# EAGLE design LEDBox (EAGLE 9.6.2)
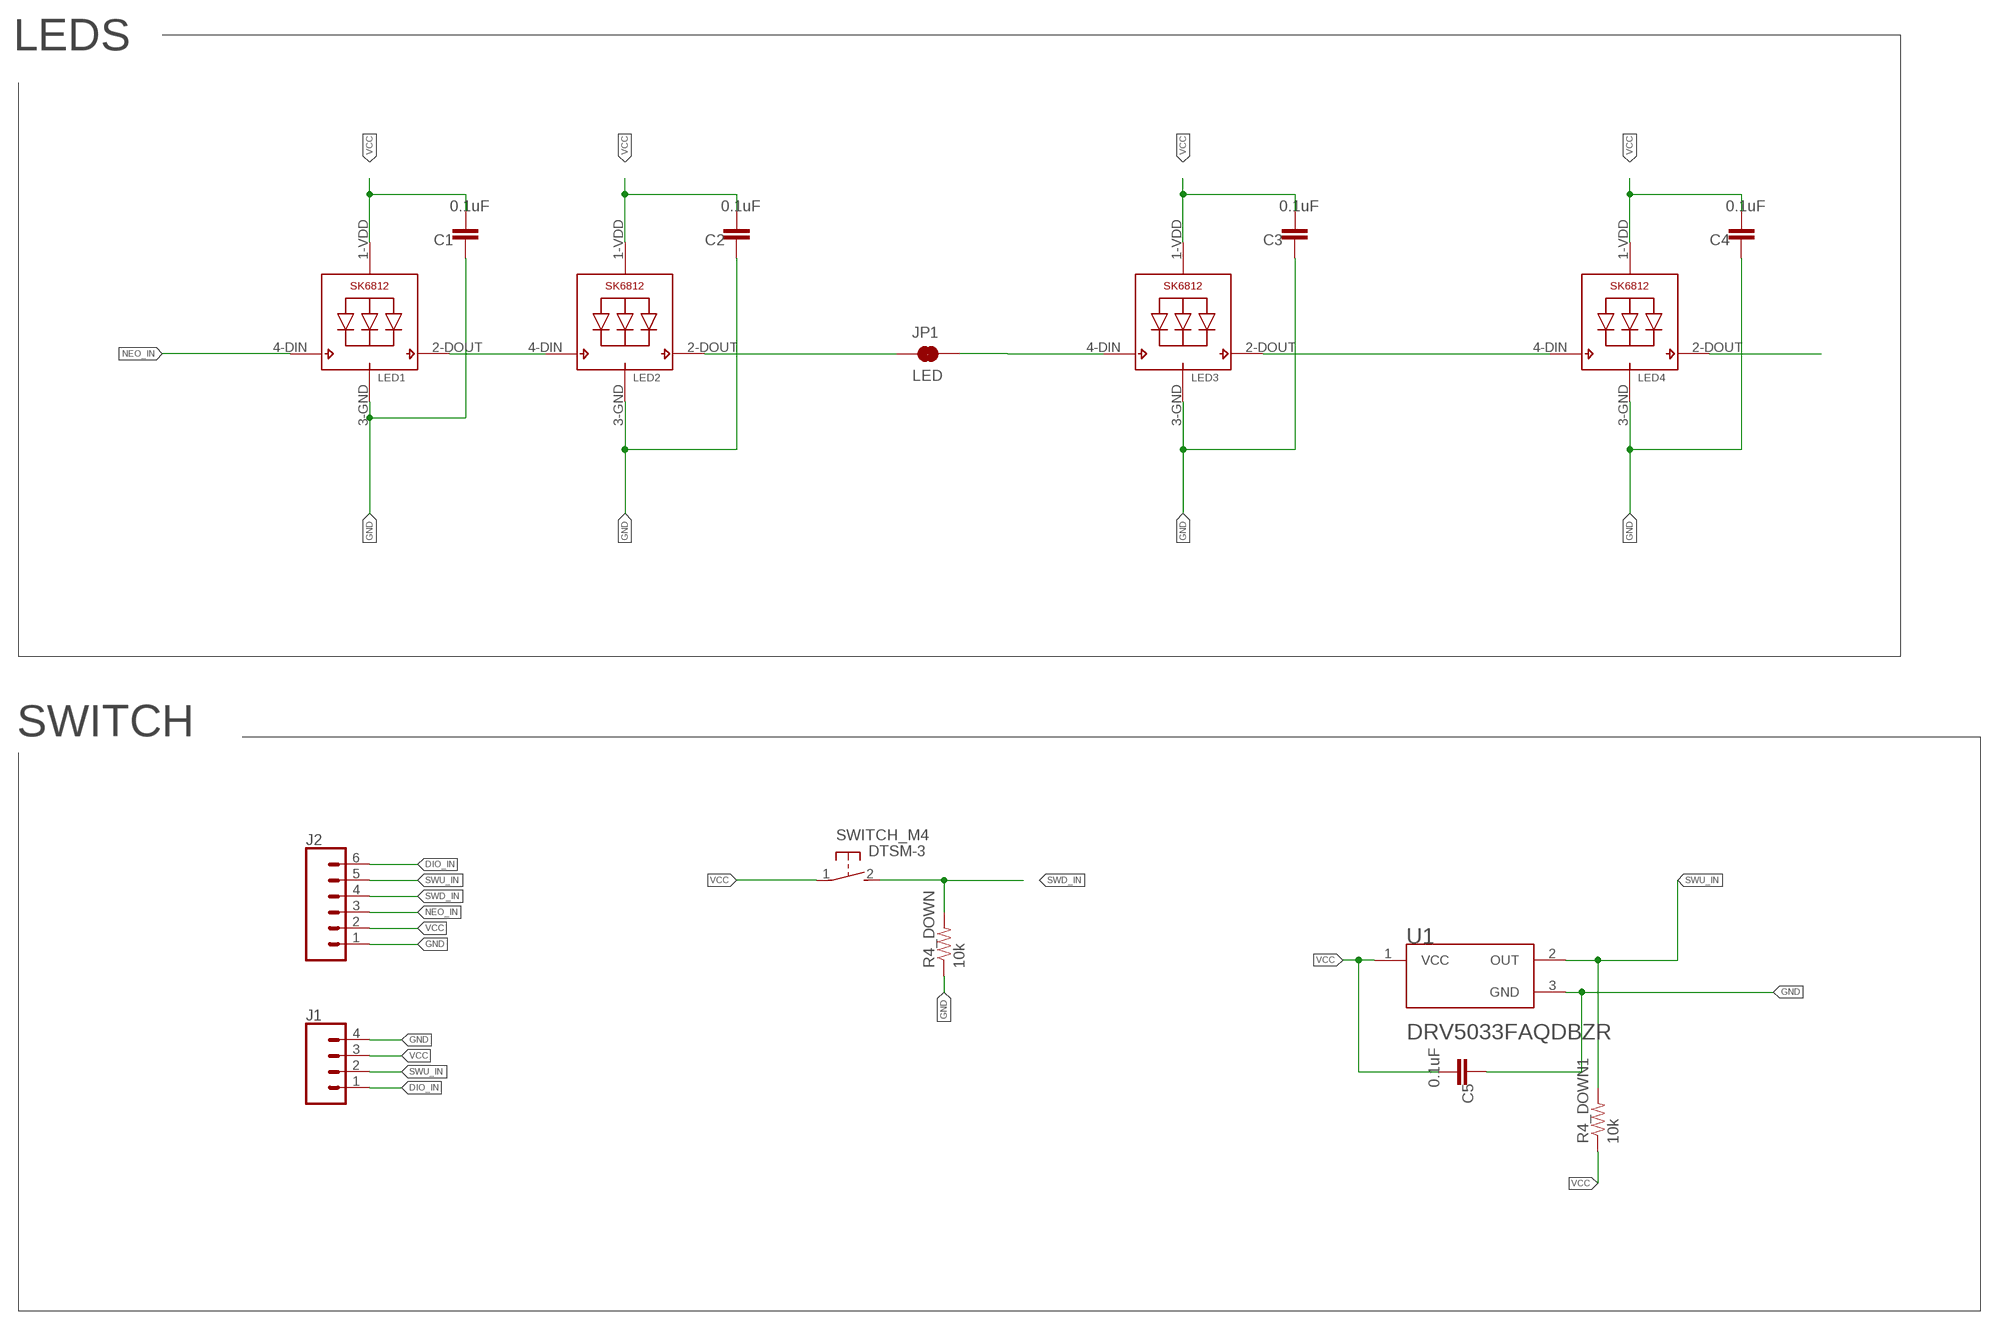
[diagram p0: schematic, sheet 1]

## Parts
C1  0.1uF  0.1UF-0603-25V-5%  [0603]
C2  0.1uF  0.1UF-0603-25V-5%  [0603]
C3  0.1uF  0.1UF-0603-25V-5%  [0603]
C4  0.1uF  0.1UF-0603-25V-5%  [0603]
C5  0.1uF  0.1UF-0603-25V-5%  [0603]
J1  CONN_041X04_NO_SILK  [1X04_NO_SILK]
J2  CONN_06SMD-1MM  [1X06-1MM]
JP1  LED  JUMPER-SMT_2_NC_TRACE_NO-SILK  [SMT-JUMPER_2_NC_TRACE_NO-SILK]
LED1  SK6812_5050W  [LED5050_W]
LED2  SK6812_5050W  [LED5050_W]
LED3  SK6812_5050W  [LED5050_W]
LED4  SK6812_5050W  [LED5050_W]
R4_DOWN  10k  10KOHM-0603-1/10W-1%  [0603]
R4_DOWN1  10k  10KOHM-0603-1/10W-1%  [0603]
SWITCH_M4  DTSM-3  [DTSM-3]
U1  TEXAS_INSTRUMENTS_DRV5033FAQDBZRTEXAS_INSTRUMENTS_DRV5033FAQDBZR_0_0  [TEXAS_INSTRUMENTS_DRV5033FAQDBZR_0]

## Nets
DIO_IN: J1.1 J2.6
GND: C1.1 C2.1 C3.1 C4.1 C5.1 J1.4 J2.1 LED1.3-GND(GND) LED2.3-GND(GND) LED3.3-GND(GND) LED4.3-GND(GND) R4_DOWN.1 U1.3(GND)
N$1: LED1.2-DOUT(DO) LED2.4-DIN(DI)
N$2: JP1.1 LED2.2-DOUT(DO)
N$4: JP1.2 LED3.4-DIN(DI)
N$5: LED4.2-DOUT(DO)
N$6: LED3.2-DOUT(DO) LED4.4-DIN(DI)
NEO_IN: J2.3 LED1.4-DIN(DI)
SWD_IN: J2.4 R4_DOWN.2 SWITCH_M4.2
SWU_IN: J1.2 J2.5 R4_DOWN1.2 U1.2(OUT)
VCC: C1.2 C2.2 C3.2 C4.2 C5.2 J1.3 J2.2 LED1.1-VDD(VDD) LED2.1-VDD(VDD) LED3.1-VDD(VDD) LED4.1-VDD(VDD) R4_DOWN1.1 SWITCH_M4.1 U1.1(VCC)

## Notes on the sheet
- LEDS
- SWITCH

## Library data of the parts
C1-C5 = SparkFun-Capacitors:0.1UF: 0.1µF ceramic capacitors A capacitor is a passive two-terminal electrical component used to store electrical energy temporarily in an electric field.; PROD_ID: CAP-08604
J1 = SparkFun-Connectors:CONN_04: Multi connection point. Often used as Generic Header-pin footprint for 0.1 inch spaced/style header connections On any of the 0.1 inch spaced packages, you can populate with these: Break Away Headers - Straight <https://www.sparkfun.com/products/116> (PRT-00116) Break Away Male Headers - Right Angle <https://www.sparkfun.com/products/553> (PRT-00553) Female Headers <https://www.sparkfun.com/products/115> (PRT-00115) Break Away Headers - Machine Pin <https://www.sparkfun.com/products/117> (PRT-00117) Break Away Female Headers - Swiss Machine Pin <https://www.sparkfun.com/products/743> (PRT-00743) For SCREWTERMINALS and SPRING TERMINALS visit here: Screw Terimnals on SparkFun.com <https://www.sparkfun.com/search/results?term=Screw+Terminals> (5mm/3.5mm/2.54mm spacing) This device is also useful as a general connection point to wire up your design to another part of your project. Our various solder wires solder well into these plated through hole pads. Hook-Up Wire - Assortment (Stranded, 22 AWG) <https://www.sparkfun.com/products/11375> (PRT-11375) Hook-Up Wire - Assortment (Solid Core, 22 AWG) <https://www.sparkfun.com/products/11367> (PRT-11367) View the entire wire category on our website here <https://www.sparkfun.com/categories/141> Special notes: Molex polarized connector foot print use with SKU : PRT-08231 with associated crimp pins and housings. 1MM SMD Version SKU: PRT-10208; PROD_ID: CONN-09696
J2 = SparkFun-Connectors:CONN_06: Multi connection point. Often used as Generic Header-pin footprint for 0.1 inch spaced/style header connections On any of the 0.1 inch spaced packages, you can populate with these: Break Away Headers - Straight <https://www.sparkfun.com/products/116> (PRT-00116) Break Away Male Headers - Right Angle <https://www.sparkfun.com/products/553> (PRT-00553) Female Headers <https://www.sparkfun.com/products/115> (PRT-00115) Break Away Headers - Machine Pin <https://www.sparkfun.com/products/117> (PRT-00117) Break Away Female Headers - Swiss Machine Pin <https://www.sparkfun.com/products/743> (PRT-00743) Arduino Stackable Header - 6 Pin <https://www.sparkfun.com/products/9280> (PRT-09280) For SCREWTERMINALS and SPRING TERMINALS visit here: Screw Terimnals on SparkFun.com <https://www.sparkfun.com/search/results?term=Screw+Terminals> (5mm/3.5mm/2.54mm spacing) This device is also useful as a general connection point to wire up your design to another part of your project. Our various solder wires solder well into these plated through hole pads. Hook-Up Wire - Assortment (Stranded, 22 AWG) <https://www.sparkfun.com/products/11375> (PRT-11375) Hook-Up Wire - Assortment (Solid Core, 22 AWG) <https://www.sparkfun.com/products/11367> (PRT-11367) View the entire wire category on our website here <https://www.sparkfun.com/categories/141>; PROD_ID: CONN-08249; SF_ID: GPS-00579
JP1 = SparkFun-Jumpers:JUMPER-SMT_2_NC_TRACE: Normally closed trace jumper This jumper has a trace between two pads so it's normally closed (NC). Use a razor knife to open the connection. For best results follow the IPC guidelines for cutting traces: Cutout at least 0.063 mm (0.005 in). Remove all loose material to clean up the cut area. Seal the cut with an approved epoxy. Reapply solder to reclose the connection.
LED1-LED4 = SK6812:SK6812
R4_DOWN R4_DOWN1 = SparkFun-Resistors:10KOHM: 10kΩ resistor A resistor is a passive two-terminal electrical component that implements electrical resistance as a circuit element. Resistors act to reduce current flow, and, at the same time, act to lower voltage levels within circuits. - Wikipedia; PROD_ID: RES-00824
SWITCH_M4 = switch-tact:DTSM-3
U1 = Texas Instruments - DRV5033FAQDBZR:TEXAS_INSTRUMENTS_DRV5033FAQDBZR: Digital Switch Omnipolar Switch Open Drain Hall Effect SOT-23-3; AMBIENT_TEMPERATURE_RANGE_HIGH: +125°C; AMBIENT_TEMPERATURE_RANGE_LOW: -40°C; AUTOMOTIVE: No; CENTROID_NOT_SPECIFIED: No; DATASHEET: https://www.ti.com/lit/gpn/DRV5033; DEVICE_CLASS_L1: Sensors; DEVICE_CLASS_L2: Magnetic Sensors; DEVICE_CLASS_L3: unset; DIGIKEY_DESCRIPTION: MAGNETIC SWITCH OMNIPOL SOT23-3; DIGIKEY_PART_NUMBER: 296-44589-1-ND; FOOTPRINT_PARAMETERS_1: {"fp_type":"SOT23","params":{"N":{"default":"3","long name":"Number of leads","type":"multichoice","short name":"N"},"A":{"nom":false,"long name":"Height","min":false,"max":1120000,"short name":"A","type":"measurement"},"A1":{"nom":false,"long name":"Package clearance","min":10000,"max":100000,"short name":"A1","type":"measurement"},"A2":{"nom":950000,"long name":"Package height","min":false,"max":false,"short name":"A2","type":"measurement"},"D":{"nom":false,"long name":"Package length","min":2800000,"max":3040000,"short name":"D","type":"measurement"},"E":{"nom":false,"long name":"Width /w leads","min":2100000,"max":2640000,"short name":"E","type":"measurement"},"E1":{"nom":false,"long name":"Package width","min":1200000,"max":1400000,"short name":"E1","type":"measurement"},"B":{"nom":false,"long name":"Lead width","min":300000,"max":500000,"short name":"B","type":"measurement"},"C":{"nom":false,"long name":"Lead thickness","min":80000,"max":200000,"short name":"C","type":"measurement"},"L":{"nom":false,"long name":"Lead foot length","min":200000,"max":600000,"short name":"L","type":"measurement"},"e":{"nom":950000,"long name":"Lead pitch","min":null,"max":null,"short name":"e","type":"measurement"},"PHI":{"nom":false,"long name":"Lead angle","min":0,"max":8000000,"short name":"PHI","type":"measurement"},"offset x":{"nom":0,"long name":"X Center offset","min":null,"max":null,"short name":"offset x","type":"measurement"},"offset y":{"nom":0,"long name":"Y Center offset","min":null,"max":null,"short name":"offset y","type":"measurement"},"LS":{"default":"Rounded rectangle","long name":"Land shape","type":"multichoice","short name":"LS"},"LS1":{"default":"Rectangle","long name":"Land shape (Pin 1)","type":"multichoice","short name":"LS1"},"solder toe":{"nom":550000,"long name":"Solder fillet (toe)","min":null,"max":null,"short name":"solder toe","type":"fixedmeasurement"},"solder heel":{"nom":450000,"long name":"Solder fillet (heel)","min":null,"max":null,"short name":"solder heel","type":"fixedmeasurement"},"solder side":{"nom":50000,"long name":"Solder fillet (side)","min":null,"max":null,"short name":"solder side","type":"fixedmeasurement"},"courtyard":{"nom":500000,"long name":"Courtyard","min":null,"max":null,"short name":"courtyard","type":"fixedmeasurement"},"SF":{"default":"A","long name":"Packing level","type":"multichoiceparent","short name":"SF","help":"http://support.upverter.com/customer/portal/articles/978783-what-is-a-footprint-packing-level","children":["solder toe","solder heel","solder side","courtyard"]}}}; FOOTPRINT_PARAMETERS_2: {"fp_type":"SOT23","params":{"N":{"default":"3","long name":"Number of leads","type":"multichoice","short name":"N"},"A":{"nom":false,"long name":"Height","min":false,"max":1120000,"short name":"A","type":"measurement"},"A1":{"nom":false,"long name":"Package clearance","min":10000,"max":100000,"short name":"A1","type":"measurement"},"A2":{"nom":950000,"long name":"Package height","min":false,"max":false,"short name":"A2","type":"measurement"},"D":{"nom":false,"long name":"Package length","min":2800000,"max":3040000,"short name":"D","type":"measurement"},"E":{"nom":false,"long name":"Width /w leads","min":2100000,"max":2640000,"short name":"E","type":"measurement"},"E1":{"nom":false,"long name":"Package width","min":1200000,"max":1400000,"short name":"E1","type":"measurement"},"B":{"nom":false,"long name":"Lead width","min":300000,"max":500000,"short name":"B","type":"measurement"},"C":{"nom":false,"long name":"Lead thickness","min":80000,"max":200000,"short name":"C","type":"measurement"},"L":{"nom":false,"long name":"Lead foot length","min":200000,"max":600000,"short name":"L","type":"measurement"},"e":{"nom":950000,"long name":"Lead pitch","min":null,"max":null,"short name":"e","type":"measurement"},"PHI":{"nom":false,"long name":"Lead angle","min":0,"max":8000000,"short name":"PHI","type":"measurement"},"offset x":{"nom":0,"long name":"X Center offset","min":null,"max":null,"short name":"offset x","type":"measurement"},"offset y":{"nom":0,"long name":"Y Center offset","min":null,"max":null,"short name":"offset y","type":"measurement"},"LS":{"default":"Rounded rectangle","long name":"Land shape","type":"multichoice","short name":"LS"},"LS1":{"default":"Rectangle","long name":"Land shape (Pin 1)","type":"multichoice","short name":"LS1"},"solder toe":{"nom":350000,"long name":"Solder fillet (toe)","min":null,"max":null,"short name":"solder toe","type":"fixedmeasurement"},"solder heel":{"nom":350000,"long name":"Solder fillet (heel)","min":null,"max":null,"short name":"solder heel","type":"fixedmeasurement"},"solder side":{"nom":30000,"long name":"Solder fillet (side)","min":null,"max":null,"short name":"solder side","type":"fixedmeasurement"},"courtyard":{"nom":250000,"long name":"Courtyard","min":null,"max":null,"short name":"courtyard","type":"fixedmeasurement"},"SF":{"default":"B","long name":"Packing level","type":"multichoiceparent","short name":"SF","help":"http://support.upverter.com/customer/portal/articles/978783-what-is-a-footprint-packing-level","children":["solder toe","solder heel","solder side","courtyard"]}}}; FOOTPRINT_PARAMETERS_3: {"fp_type":"SOT23","params":{"N":{"default":"3","long name":"Number of leads","type":"multichoice","short name":"N"},"A":{"nom":false,"long name":"Height","min":false,"max":1120000,"short name":"A","type":"measurement"},"A1":{"nom":false,"long name":"Package clearance","min":10000,"max":100000,"short name":"A1","type":"measurement"},"A2":{"nom":950000,"long name":"Package height","min":false,"max":false,"short name":"A2","type":"measurement"},"D":{"nom":false,"long name":"Package length","min":2800000,"max":3040000,"short name":"D","type":"measurement"},"E":{"nom":false,"long name":"Width /w leads","min":2100000,"max":2640000,"short name":"E","type":"measurement"},"E1":{"nom":false,"long name":"Package width","min":1200000,"max":1400000,"short name":"E1","type":"measurement"},"B":{"nom":false,"long name":"Lead width","min":300000,"max":500000,"short name":"B","type":"measurement"},"C":{"nom":false,"long name":"Lead thickness","min":80000,"max":200000,"short name":"C","type":"measurement"},"L":{"nom":false,"long name":"Lead foot length","min":200000,"max":600000,"short name":"L","type":"measurement"},"e":{"nom":950000,"long name":"Lead pitch","min":null,"max":null,"short name":"e","type":"measurement"},"PHI":{"nom":false,"long name":"Lead angle","min":0,"max":8000000,"short name":"PHI","type":"measurement"},"offset x":{"nom":0,"long name":"X Center offset","min":null,"max":null,"short name":"offset x","type":"measurement"},"offset y":{"nom":0,"long name":"Y Center offset","min":null,"max":null,"short name":"offset y","type":"measurement"},"LS":{"default":"Rounded rectangle","long name":"Land shape","type":"multichoice","short name":"LS"},"LS1":{"default":"Rectangle","long name":"Land shape (Pin 1)","type":"multichoice","short name":"LS1"},"solder toe":{"nom":150000,"long name":"Solder fillet (toe)","min":null,"max":null,"short name":"solder toe","type":"fixedmeasurement"},"solder heel":{"nom":250000,"long name":"Solder fillet (heel)","min":null,"max":null,"short name":"solder heel","type":"fixedmeasurement"},"solder side":{"nom":10000,"long name":"Solder fillet (side)","min":null,"max":null,"short name":"solder side","type":"fixedmeasurement"},"courtyard":{"nom":100000,"long name":"Courtyard","min":null,"max":null,"short name":"courtyard","type":"fixedmeasurement"},"SF":{"default":"C","long name":"Packing level","type":"multichoiceparent","short name":"SF","help":"http://support.upverter.com/customer/portal/articles/978783-what-is-a-footprint-packing-level","children":["solder toe","solder heel","solder side","courtyard"]}}}; FOOTPRINT_VARIANT_NAME_0: Recommended_Land_Pattern; FOOTPRINT_VARIANT_NAME_1: IPC_A; FOOTPRINT_VARIANT_NAME_2: IPC_B; FOOTPRINT_VARIANT_NAME_3: IPC_C; HEIGHT: 1.12mm; LEAD_FREE: Yes; MAX_JUNCTION_TEMP: +150°C; MAX_SUPPLY_VOLTAGE: 38V; MF: Texas Instruments; MFG_PACKAGE_IDENT: DBZ0003A; MFG_PACKAGE_IDENT_COMPONENT_ID: 9486d0fa5c97c3d3; MFG_PACKAGE_IDENT_DATE: 0; MFG_PACKAGE_IDENT_REV: 0; MIN_SUPPLY_VOLTAGE: 2.5V; MOUSER_DESCRIPTION: High voltage (up to 38V), high bandwidth (up to 30 kHz) omnipolar switch 3-SOT-23 -40 to 125; MOUSER_PART_NUMBER: 595-DRV5033FAQDBZR; MPN: DRV5033FAQDBZR; OPERATING_SUPPLY_CURRENT: 2.7-3mA; OUTPUT_CURRENT: 30mA; OUTPUT_VOLTAGE: 38V; PACKAGE: SOT23-3; PREFIX: U; ROHS: Yes; SENSING_METHOD: Hall Effect; STANDOFF_HEIGHT: 0.01mm; TEMPERATURE_RANGE_HIGH: +125°C; TEMPERATURE_RANGE_LOW: -40°C; VERIFICATION_VERSION: 0.0.0.3

## Net classes
0 default: drill 0.35 mm, clearance 0.2 mm
1 gnd: width 0.2 mm, drill 0.508 mm, clearance 0.2 mm
3 vcc: width 0.2 mm, drill 0.508 mm, clearance 0.2 mm

## Board
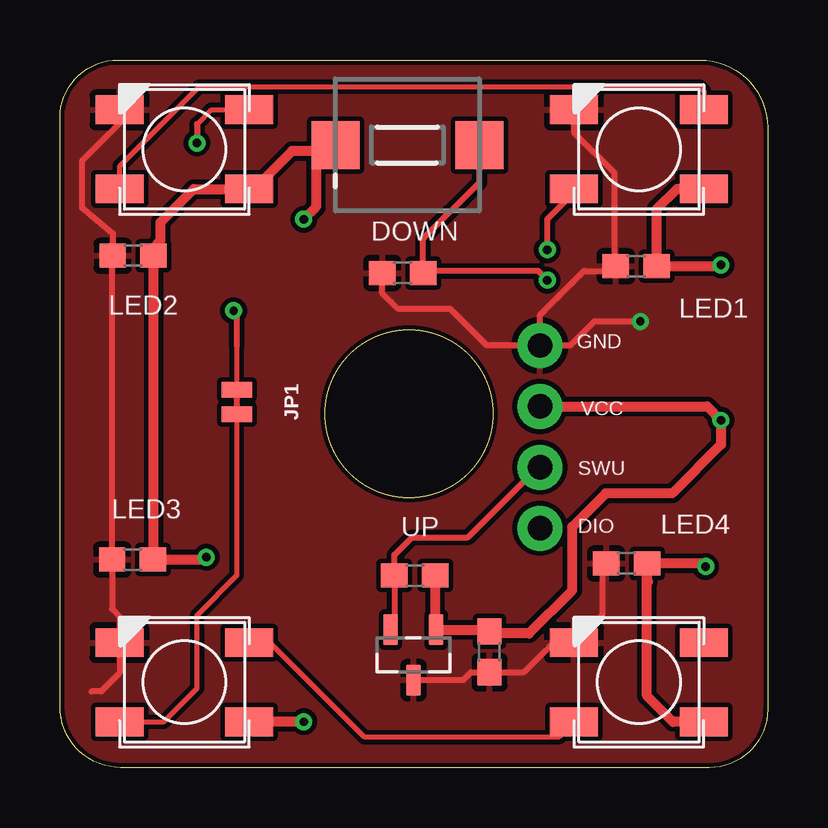
[diagram p1: board, top side]
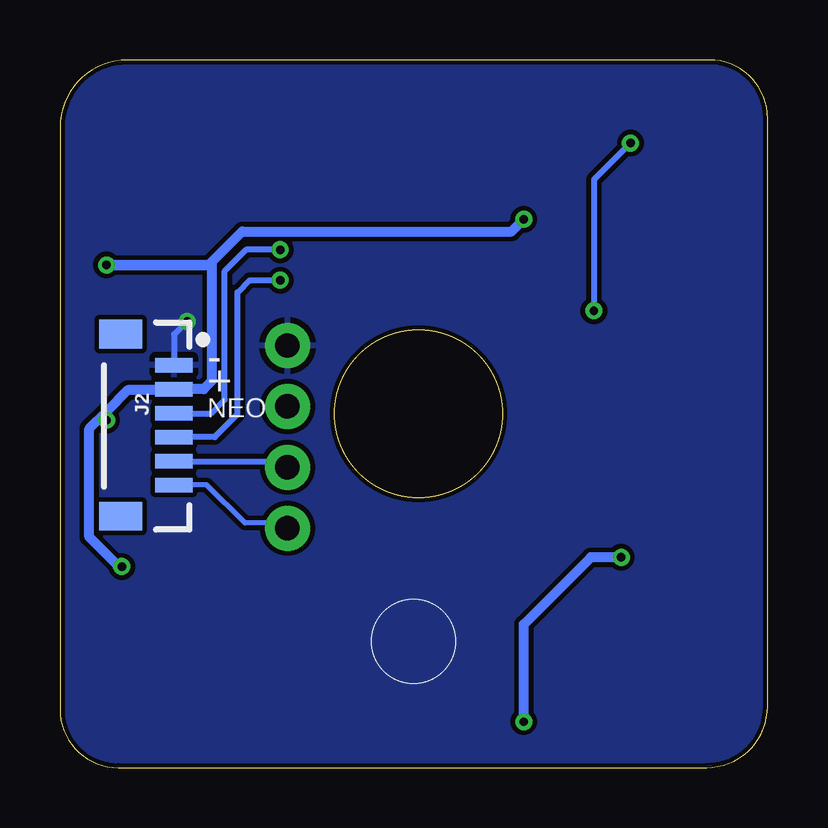
[diagram p2: board, bottom side, seen from below]

Size 29.5 x 29.5 mm. Coordinates in mm from the lower left corner, seen from the top.
Outline: 27.08,0 2.54,0 arc-90 0,2.54 0,27.08 arc-90 2.42,29.5 26.7,29.5 arc-90 29.5,26.7 29.5,2.42 arc-90 27.08,0
Outline: circle at 14.55,14.75 radius 3.5
Copper layers (1*16): Top 0.035mm / dielectric 1.5mm / Bottom 0.035mm
Design rules "SparkFun-2-Layer-General-JLCPCB": minimum track width 7mil, minimum drill 0.3mm, track to track 7mil, track to pad 7mil, pad to pad 7mil, via to via 7mil, smd to smd 7mil, copper to edge 7mil, drill to drill 7mil, minimum pad ring 7mil, minimum via ring 7mil, stop-mask expansion 3mil, vias tented up to drill 25mil, thermal gap 10mil

### Footprints (pad centres in the part's own frame; a part is rotated, then mirrored left to right if it is on the bottom)
0603 = smd 1.1 x 1: 1 -0.85,0; 2 0.85,0
1X04_NO_SILK = drill 1.016 pad 1.88: 1 0,0; 2 2.54,0; 3 5.08,0; 4 7.62,0
1X06-1MM = smd 0.6 x 1.55: 1 -2.54,1.27; 2 -1.54,1.27; 3 -0.54,1.27; 4 0.46,1.27; 5 1.46,1.27; 6 2.46,1.27 | smd 1.2 x 1.8: P$1 -3.84,-0.955; P$2 3.76,-0.955
SMT-JUMPER_2_NC_TRACE_NO-SILK = smd 0.635 x 1.27: 1 -0.508,0; 2 0.508,0
LED5050_W = smd 2 x 1.2: 1-VDD 2.7,-1.65; 2-DOUT 2.7,1.65; 3-GND -2.7,1.65; 4-DIN -2.7,-1.65
DTSM-3 = smd 2 x 2: 1 -3,0; 2 3,0
TEXAS_INSTRUMENTS_DRV5033FAQDBZR_0 = smd 1.3 x 0.6: 1 -1.05,0.95; 2 -1.05,-0.95; 3 1.05,0

### Placement (x,y rotation side)
C1  24.02,20.9 0 top
C2  3.03,8.67 0 top
C3  3.05,21.34 0 top
C4  23.62,8.51 0 top
C5  17.91,4.83 90 top
J1  20.01,9.98 90 top
J2  26.02,14.24 270 bottom
JP1  7.37,15.24 270 top
LED1  24.14,25.77 0 top
LED2  5.19,25.77 0 top
LED3  5.19,3.56 0 top
LED4  24.14,3.56 0 top
R4_DOWN  14.29,20.62 0 top
R4_DOWN1  14.8,8 180 top
SWITCH_M4  14.48,25.96 0 top
U1  14.73,4.7 270 top

### Tracks (layer width: path | path; a pad name or v marks a point on that pad's centre or on a via)
DIO_IN
  Bottom 0.2: J2.6 24.59,11.79 23.39,11.79 21.79,10.19 20.39,10.19 20.19,9.99 J1.1
GND  (via drill 0.35)
  Top 0.254: U1.3 16.82,3.65 17.14,3.98 C5.1 19.34,3.98 20.57,5.21 LED4.3-GND 22.61,6.38 22.61,8.25 22.61,8.35 C4.1 | LED2.3-GND 2.49,26.87 0.91,25.29 0.91,23.35 2.2,22.27 C3.1 2.3,21.24 2.18,21.12 C2.1 2.18,6.69 2.17,6.61 2.49,6.29 LED3.3-GND 2.49,3.95 1.71,3.17 1.31,3.17 | LED1.3-GND 21.44,26.48 23.11,24.8 23.11,20.75 C1.1 | J1.4 20.01,18.87 21.85,20.7 23.1,20.7 | R4_DOWN.1 13.44,19.79 14.11,19.12 16.27,19.12 17.79,17.6 J1.4 | v24.2,18.6 22.29,18.6 21.29,17.6 J1.4
  Bottom 0.254: J2.1 24.75,18.05 v24.2,18.6
  pour Top (isolate 0.005): -3.3,29.97 33.02,29.97 33.02,-2.03 -3.3,-2.03
  pour Bottom (isolate 0.005): -2.29,30.73 36.83,30.73 36.83,-3.05 -2.29,-3.05
N$1
  Top 0.2: LED2.4-DIN 2.49,25.06 5.8,28.38 26.67,28.38 26.84,28.21 LED1.2-DOUT
N$2  (via drill 0.35)
  Top 0.2: 5.71,26.83 6.31,27.42 LED2.2-DOUT | 7.37,17.59 JP1.1
  Top 0.254: LED2.2-DOUT 7.49,27.82 | 5.71,26.83 v5.71,26.04 | v7.24,19.05 7.37,18.92 7.37,17.59
  Bottom 0.254: v5.71,26.04 7.24,24.51 v7.24,19.05
N$4
  Top 0.2: LED3.4-DIN 4.32,1.91 5.71,3.3 5.71,6.35 7.37,8 JP1.2
N$6
  Top 0.2: LED4.4-DIN 20.8,1.27 12.7,1.27 8.76,5.21 LED3.2-DOUT
NEO_IN  (via drill 0.35)
  Top 0.254: v20.32,21.59 20.32,22.86 21.44,23.98 LED1.4-DIN
  Bottom 0.254: J2.3 24.74,14.77 23.2,14.77 22.63,15.34 22.63,20.71 21.74,21.59 v20.32,21.59
SWD_IN  (via drill 0.35)
  Top 0.254: SWITCH_M4.2 17.48,24.39 15.14,22.05 R4_DOWN.2 15.21,20.7 19.94,20.7 v20.32,20.32
  Bottom 0.254: J2.4 23.05,13.78 22.1,14.73 22.1,19.81 21.59,20.32 v20.32,20.32
SWU_IN
  Top 0.254: U1.2 13.95,5.91 R4_DOWN1.2 13.95,8.87 14.67,9.59 17.01,9.59 19.93,12.52 J1.2
  Bottom 0.254: J2.5 24.74,12.77 20.27,12.77 J1.2
VCC  (via drill 0.35)
  Top 0.406: 4.01,8.54 | 4.01,8.54 3.9,8.65 C3.2 4.06,21.84 4.19,21.97 4.19,22.73 5.58,24.12 LED2.1-VDD 8.09,24.12 9.67,25.7 11.23,25.7 SWITCH_M4.1 10.97,25.96 10.67,25.65 10.67,23.37 v10.16,22.86 | 4.01,8.54 C2.2 | C2.2 | LED4.1-VDD 25.56,1.91 24.47,2.99 C4.2 | 24.51,7.75 24.47,8.1 C4.2 | R4_DOWN1.1 15.65,5.79 U1.1 17.83,5.75 C5.2 18,5.59 19.56,5.59 21.36,7.39 21.36,10.03 22.75,11.43 25.53,11.43 27.56,13.46 v27.56,14.48 26.98,15.06 J1.3 | v27.56,20.96 27.5,20.9 C1.2 24.87,23.27 25.72,24.12 LED1.1-VDD | C2.2 6,8.67 v6.1,8.76 | v26.92,8.38 26.8,8.51 C4.2 | v10.16,1.91 LED3.1-VDD
  Bottom 0.406: v6.1,8.76 7.37,8.76 10.16,5.97 v10.16,1.91 | v26.92,8.38 27.05,8.38 28.27,9.6 28.27,14.13 27.56,14.85 | 27.56,14.85 v27.56,14.48 | 27.56,14.85 26.67,15.74 24.79,15.74 J2.2 23.51,15.78 23.16,16.13 23.16,20.96 v27.56,20.96 23.29,20.96 21.9,22.35 10.67,22.35 v10.16,22.86

### Text on the board
tPlace: DOWN | GND | VCC | SWU | DIO | UP
bPlace: - | + | NEO